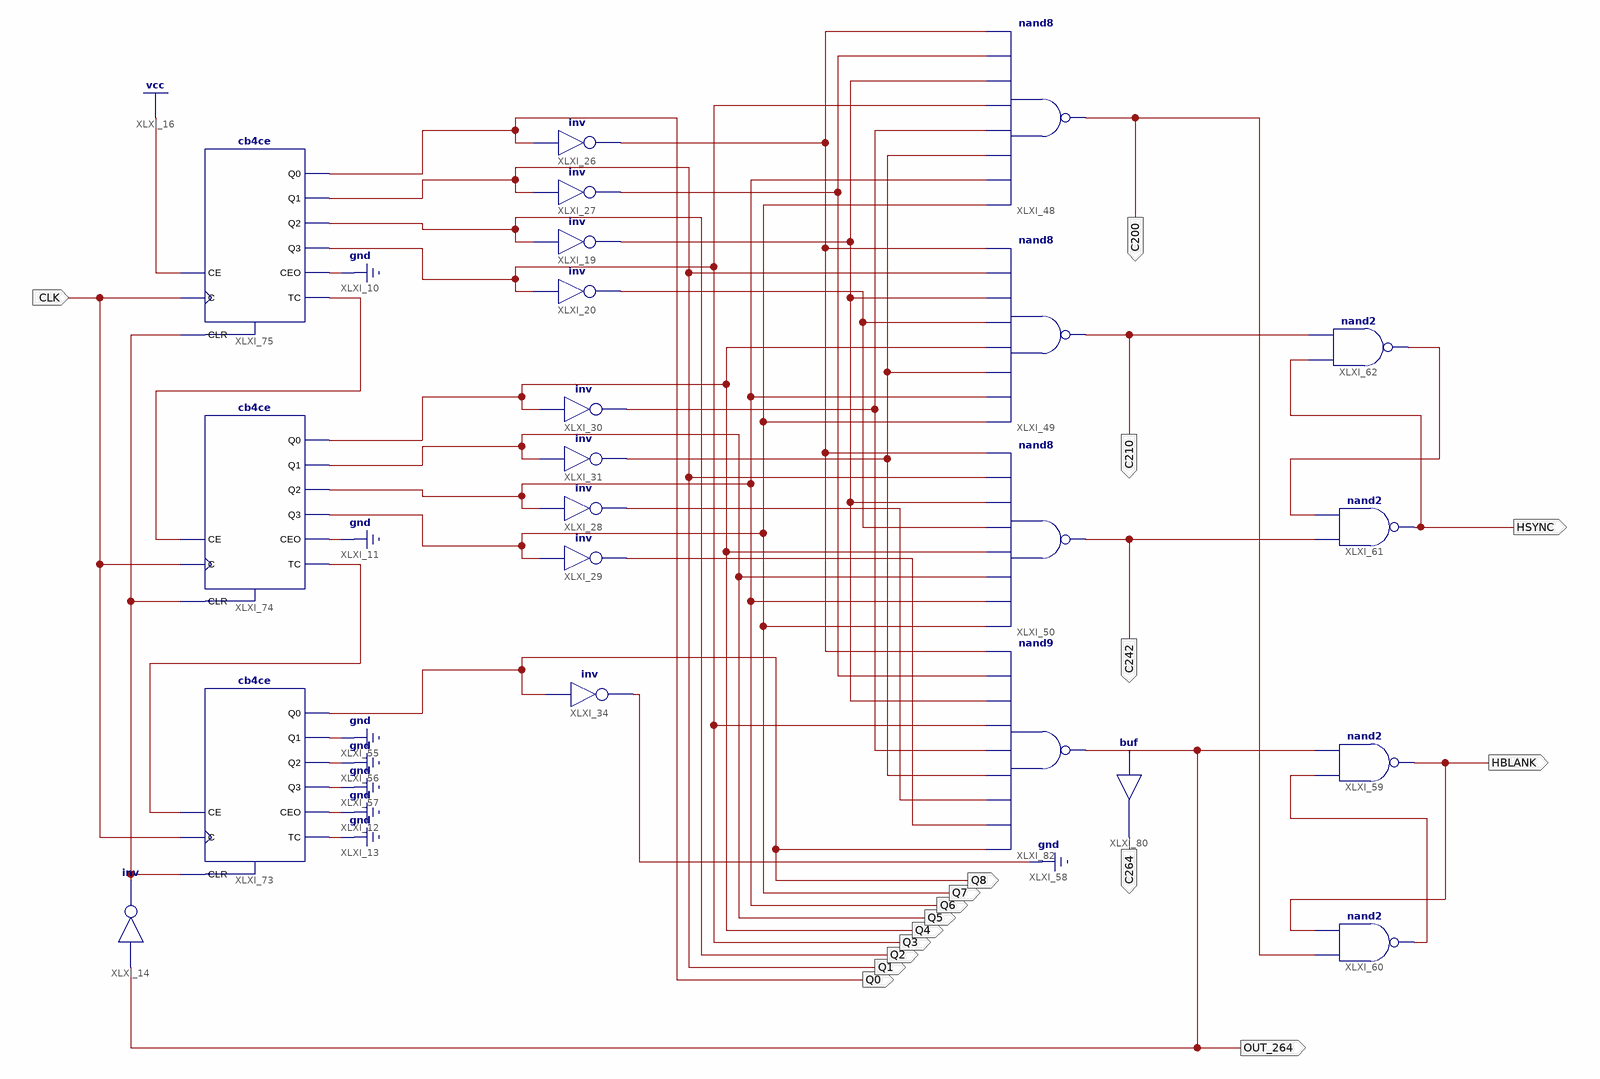
[diagram p0: schematic sheet 1]
// Xilinx ISE schematic Horizontal_Sync.sch (spartan6) as structural Verilog: 22 symbols, 17 ports
module Horizontal_Sync (
  input  CLK,
  output Q0,
  output Q1,
  output Q2,
  output Q3,
  output Q4,
  output Q5,
  output Q6,
  output Q7,
  output Q8,
  output OUT_264,
  output HBLANK,
  output HSYNC,
  output C264,
  output C242,
  output C210,
  output C200
);

  wire XLXN_1, XLXN_2, XLXN_8, XLXN_18, XLXN_36, XLXN_38, XLXN_40, XLXN_42, XLXN_105, XLXN_108, XLXN_136,
       XLXN_140, XLXN_144;

  // inv XLXI_34 has open pins: I=Q8, O=1'b0
  not XLXI_19 (XLXN_18, Q2);
  not XLXI_20 (XLXN_108, Q3);
  not XLXI_26 (XLXN_136, Q0);
  not XLXI_27 (XLXN_105, Q1);
  not XLXI_31 (XLXN_42, Q5);
  not XLXI_30 (XLXN_40, Q4);
  not XLXI_29 (XLXN_38, Q7);
  not XLXI_28 (XLXN_36, Q6);
  nand XLXI_49 (C210, Q7, Q6, XLXN_42, Q4, XLXN_108, XLXN_18, Q1, XLXN_136);
  nand XLXI_50 (C242, Q7, Q6, Q5, Q4, XLXN_108, XLXN_18, Q1, XLXN_136);
  nand XLXI_59 (HBLANK, XLXN_140, OUT_264);
  nand XLXI_60 (XLXN_140, C200, HBLANK);
  nand XLXI_61 (HSYNC, C242, XLXN_144);
  nand XLXI_62 (XLXN_144, HSYNC, C210);
  nand XLXI_48 (C200, Q7, Q6, XLXN_42, XLXN_40, Q3, XLXN_18, XLXN_105, XLXN_136);
  not XLXI_14 (XLXN_8, OUT_264);
  cb4ce XLXI_73 (.C(CLK), .CE(XLXN_2), .CLR(XLXN_8), .CEO(1'b0), .Q0(Q8), .Q1(1'b0), .Q2(1'b0), .Q3(1'b0), .TC(1'b0));
  cb4ce XLXI_74 (.C(CLK), .CE(XLXN_1), .CLR(XLXN_8), .CEO(1'b0), .Q0(Q4), .Q1(Q5), .Q2(Q6), .Q3(Q7), .TC(XLXN_2));
  cb4ce XLXI_75 (.C(CLK), .CE(1'b1), .CLR(XLXN_8), .CEO(1'b0), .Q0(Q0), .Q1(Q1), .Q2(Q2), .Q3(Q3), .TC(XLXN_1));
  buf XLXI_80 (C264, OUT_264);
  nand XLXI_82 (OUT_264, Q8, XLXN_38, XLXN_36, XLXN_42, XLXN_40, Q3, XLXN_18, XLXN_105, XLXN_136);
endmodule
